# EAGLE design RiseUpBOTTOM (EAGLE 9.6.1)
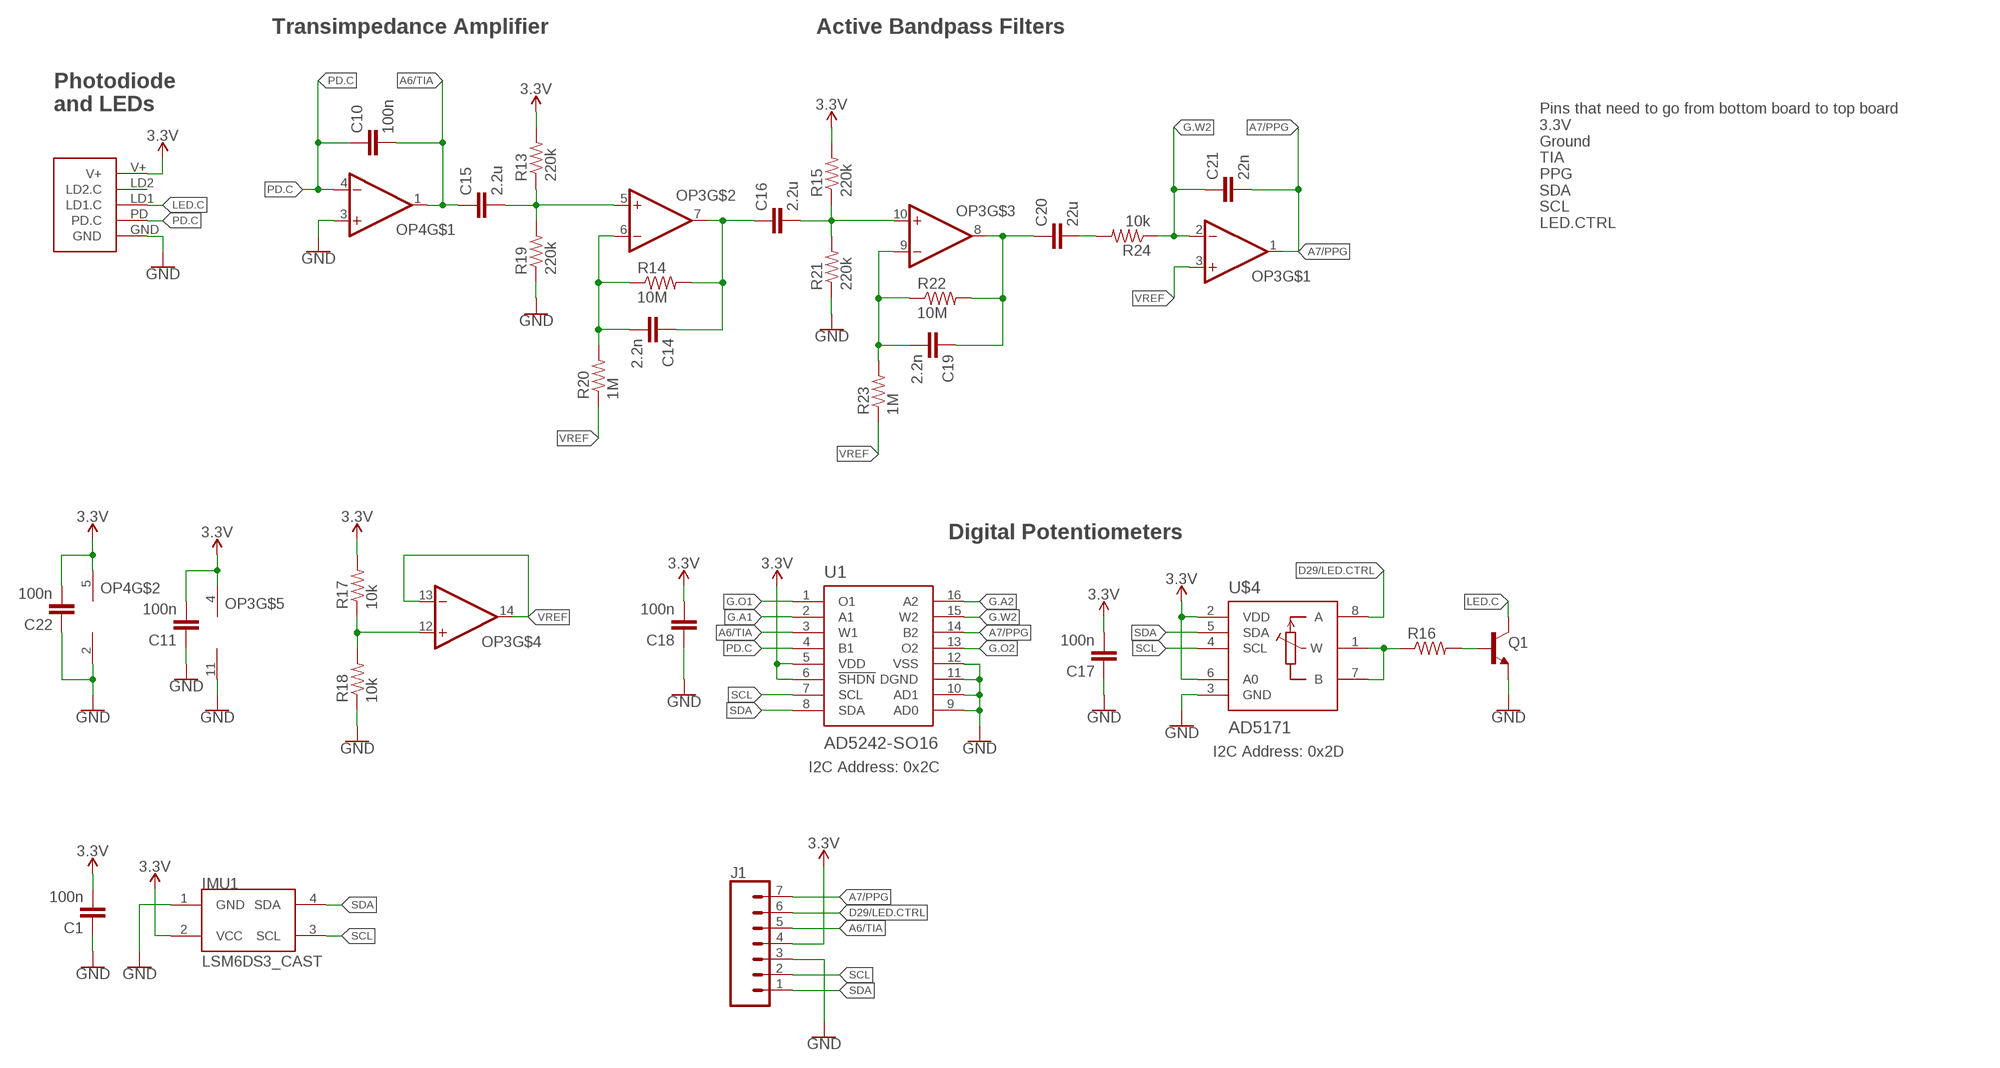
[diagram p0: schematic, sheet 1]

## Parts
C1  100n  CAPACITOR0603  [C0603]
C10  100n  CAPACITOR0603  [C0603]
C11  100n  CAPACITOR0603  [C0603]
C14  2.2n  CAPACITOR0603  [C0603]
C15  2.2u  CAPACITOR0603  [C0603]
C16  2.2u  CAPACITOR0603  [C0603]
C17  100n  CAPACITOR0603  [C0603]
C18  100n  CAPACITOR0603  [C0603]
C19  2.2n  CAPACITOR0603  [C0603]
C20  22u  CAPACITOR0603  [C0603]
C21  22n  CAPACITOR0603  [C0603]
C22  100n  CAPACITOR0603  [C0603]
IMU1  LSM6DS3_CAST  [LSM6DS3_CAST]
J1  CONN_07  [1X07]
OP3  OP-QUAD-SO14  [SO14]
OP4  OP-SINGLEOT  [SOT23-5]
Q1  NPN-GENERIC  [SOT23-3]
R13  220k  RESISTOR0603  [R0603]
R14  10M  RESISTOR0603  [R0603]
R15  220k  RESISTOR0603  [R0603]
R16  RESISTOR0603  [R0603]
R17  10k  RESISTOR0402  [R0402]
R18  10k  RESISTOR0402  [R0402]
R19  220k  RESISTOR0603  [R0603]
R20  1M  RESISTOR0603  [R0603]
R21  220k  RESISTOR0603  [R0603]
R22  10M  RESISTOR0603  [R0603]
R23  1M  RESISTOR0603  [R0603]
R24  10k  RESISTOR0603  [R0603]
U1  AD5242-SO16  [SO16]
U$3  PPG.MODULE.2  [PPG.MODULE.2]
U$4  AD5171  [SOT-23-8]

## Nets
3.3V: C1.2 C11.2 C17.2 C18.2 C22.2 IMU1.2(VCC) J1.4 OP3.4(V+) OP4.5(V+) R13.2 R15.2 R17.2 U1.5(VDD) U1.6(!SHDN) U$3.V+ U$4.2(VDD) U$4.6(A0)
A6/TIA: C10.2 C15.1 J1.5 OP4.1(OUT) U1.3(W1)
A7/PPG: C21.2 J1.7 OP3.1(OUT) U1.14(B2)
D29/LED.CTRL: J1.6 U$4.8(A)
G.A1: U1.2(A1)
G.A2: U1.16(A2)
G.O1: U1.1(O1)
G.O2: U1.13(O2)
G.W2: C21.1 OP3.2(-IN) R24.1 U1.15(W2)
GND: C1.1 C11.1 C17.1 C18.1 C22.1 IMU1.1(GND) J1.3 OP3.11(V-) OP4.2(V-) OP4.3(+IN) Q1.2(E) R18.1 R19.1 R21.1 U1.9(AD0) U1.10(AD1) U1.11(DGND) U1.12(VSS) U$3.GND U$4.3(GND)
LED.C: Q1.3(C) U$3.LD1(LD1.C)
N$8: Q1.1(B) R16.2
N$9: R16.1 U$4.1(W) U$4.7(B)
N$10: OP3.12(+IN) R17.1 R18.2
N$13: C15.2 OP3.5(+IN) R13.1 R19.2
N$15: C14.2 OP3.6(-IN) R14.1 R20.2
N$16: C14.1 C16.1 OP3.7(OUT) R14.2
N$17: C16.2 OP3.10(+IN) R15.1 R21.2
N$18: C19.2 OP3.9(-IN) R22.1 R23.2
N$19: C19.1 C20.1 OP3.8(OUT) R22.2
N$20: C20.2 R24.2
PD.C: C10.1 OP4.4(-IN) U1.4(B1) U$3.PD(PD.C)
SCL: IMU1.3(SCL) J1.2 U1.7(SCL) U$4.4(SCL)
SDA: IMU1.4(SDA) J1.1 U1.8(SDA) U$4.5(SDA)
VREF: OP3.3(+IN) OP3.13(-IN) OP3.14(OUT) R20.1 R23.1
Unconnected: U$3.LD2(LD2.C)

## Notes on the sheet
- Transimpedance Amplifier | Active Bandpass Filters
- Photodiode
  and LEDs
- Pins that need to go from bottom board to top board 
  3.3V
  Ground
  TIA 
  PPG 
  SDA
  SCL
  LED.CTRL
- Digital Potentiometers
- I2C Address: 0x2D
- I2C Address: 0x2C

## Library data of the parts
C1 C10 C11 C14-C22 = LinnesLab-Passives:CAPACITOR
IMU1 = LinnesLab-Sensors:LSM6DS3_CAST
J1 = LinnesLab-Connectors:CONN_07: Multi connection point. Often used as Generic Header-pin footprint for 0.1 inch spaced/style header connections On any of the 0.1 inch spaced packages, you can populate with these: Break Away Headers - Straight <https://www.sparkfun.com/products/116> (PRT-00116) Break Away Male Headers - Right Angle <https://www.sparkfun.com/products/553> (PRT-00553) Female Headers <https://www.sparkfun.com/products/115> (PRT-00115) Break Away Headers - Machine Pin <https://www.sparkfun.com/products/117> (PRT-00117) Break Away Female Headers - Swiss Machine Pin <https://www.sparkfun.com/products/743> (PRT-00743) For SCREWTERMINALS and SPRING TERMINALS visit here: Screw Terimnals on SparkFun.com <https://www.sparkfun.com/search/results?term=Screw+Terminals> (5mm/3.5mm/2.54mm spacing) This device is also useful as a general connection point to wire up your design to another part of your project. Our various solder wires solder well into these plated through hole pads. Hook-Up Wire - Assortment (Stranded, 22 AWG) <https://www.sparkfun.com/products/11375> (PRT-11375) Hook-Up Wire - Assortment (Solid Core, 22 AWG) <https://www.sparkfun.com/products/11367> (PRT-11367) View the entire wire category on our website here <https://www.sparkfun.com/categories/141> Special notes: Molex polarized connector foot print use with SKU : PRT-08231 with associated crimp pins and housings. 1MM SMD Version SKU: PRT-10208 NOTES ON THE VARIANTS LOCK and LOCK_LONGPADS... This footprint was designed to help hold the alignment of a through-hole component (i.e. 6-pin header) while soldering it into place. You may notice that each hole has been shifted either up or down by 0.005 of an inch from it's more standard position (which is a perfectly straight line). This slight alteration caused the pins (the squares in the middle) to touch the edges of the holes. Because they are alternating, it causes a "brace" to hold the component in place. 0.005 has proven to be the perfect amount of "off-center" position when using our standard breakaway headers. Although looks a little odd when you look at the bare footprint, once you have a header in there, the alteration is very hard to notice. Also,if you push a header all the way into place, it is covered up entirely on the bottom side.
OP3 = LinnesLab-AnalogIC:OP-QUAD: General symbol and footprints for Quad Op Amps. Use with any standard general purpose op amp.
OP4 = LinnesLab-AnalogIC:OP-SINGLE: Single Op Amp 2.7V to 6.0V Single Supply CMOS Source: http://ww1.microchip.com/downloads/en/DeviceDoc/21314g.pdf
Q1 = LinnesLab-DiscreteSemi:NPN
R13-R24 = LinnesLab-Passives:RESISTOR
U1 = LinnesLab-DigitalIC:AD5242
U$3 = LinnesLab-Connectors:PPG.MODULE.2: Digi-Key Part Number: S9014E-50-ND Manufacturer Part Number: GRPB501VWVN-RC Description: 1mm insulation height 0.05in pitch 50 positions
U$4 = LinnesLab-DigitalIC:AD5171

## Board
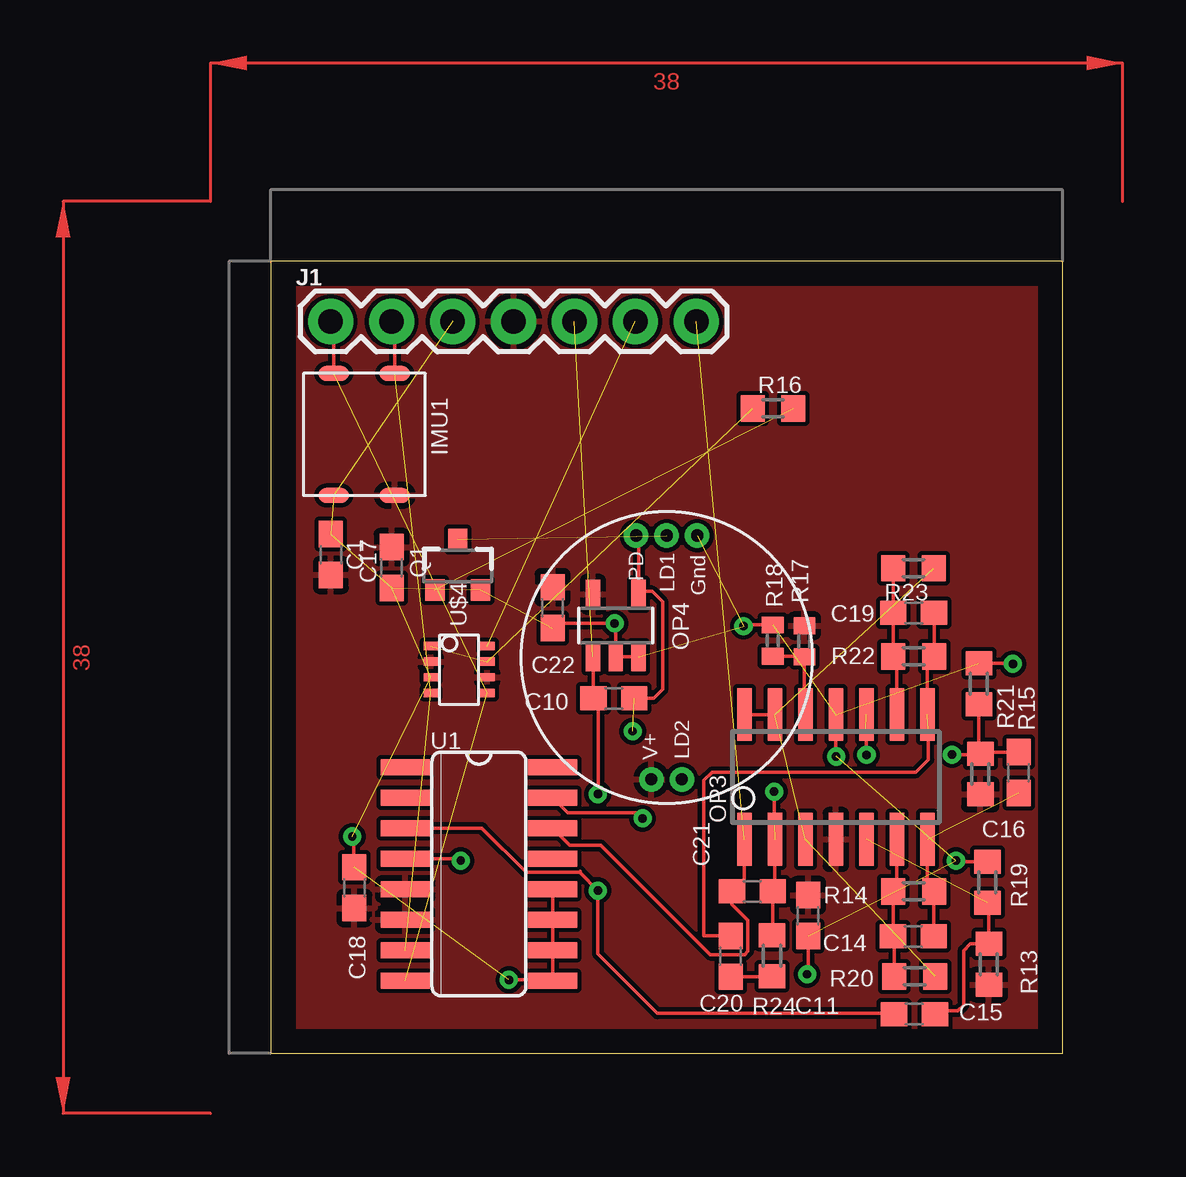
[diagram p1: board, top side]
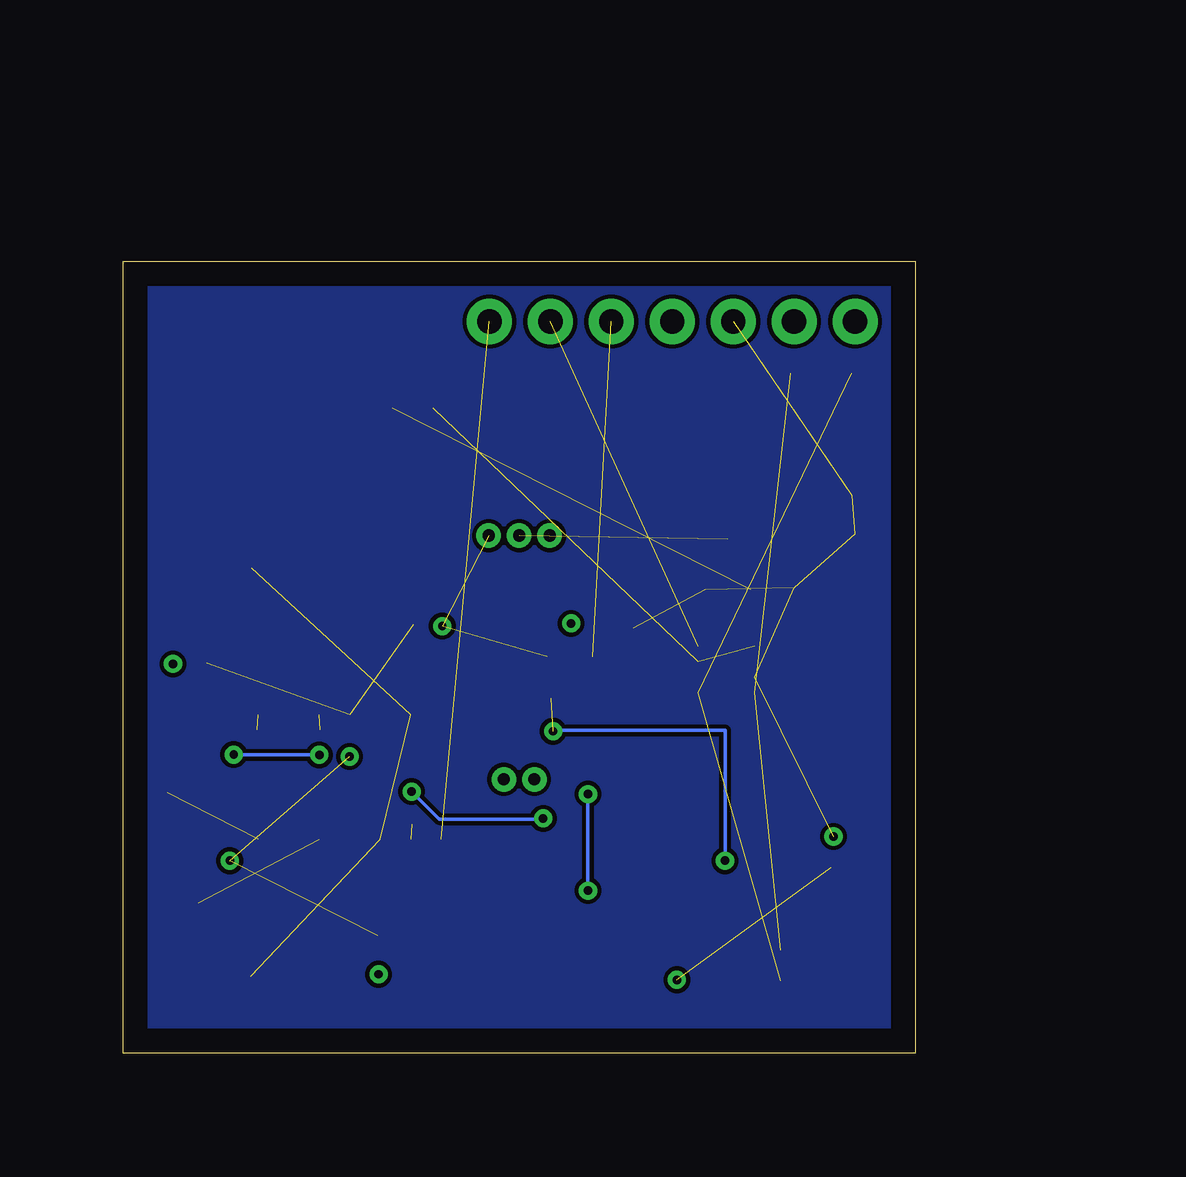
[diagram p2: board, bottom side, seen from below]

Size 33 x 33 mm. Coordinates in mm from the lower left corner, seen from the top.
Outline: 0,0 33,0 33,33 0,33 0,0
Copper layers (1*16): Top 0.035mm / dielectric 1.5mm / Bottom 0.035mm
Design rules "default": minimum track width 6mil, minimum drill 0.35mm, track to track 6mil, track to pad 6mil, pad to pad 6mil, via to via 6mil, smd to smd 6mil, copper to edge 40mil, drill to drill 6mil, minimum pad ring 10mil, minimum via ring 8mil, stop-mask expansion 4mil, vias tented up to drill 0mil, thermal gap 10mil

### Footprints (pad centres in the part's own frame; a part is rotated, then mirrored left to right if it is on the bottom)
C0603 = smd 1.1 x 1: 1 -0.85,0; 2 0.85,0
LSM6DS3_CAST = smd 0.635 x 1.27: 1 -2.54,1.27; 2 -2.54,-1.27; 3 2.54,-1.27; 4 2.54,1.27
1X07 = drill 1.016 pad 1.88: 1 0,0; 2 2.54,0; 3 5.08,0; 4 7.62,0; 5 10.16,0; 6 12.7,0; 7 15.24,0
SO14 = smd 0.6 x 2.2: 1 -3.81,-2.6; 2 -2.54,-2.6; 3 -1.27,-2.6; 4 0,-2.6; 5 1.27,-2.6; 6 2.54,-2.6; 7 3.81,-2.6; 8 3.81,2.6; 9 2.54,2.6; 10 1.27,2.6; 11 0,2.6; 12 -1.27,2.6; 13 -2.54,2.6; 14 -3.81,2.6
SOT23-5 = smd 0.6 x 1.2: 1 -0.95,-1.306; 2 0,-1.306; 3 0.95,-1.306; 4 0.95,1.306; 5 -0.95,1.306
SOT23-3 = smd 0.8 x 0.9: 1 -0.95,-1; 2 0.95,-1; 3 0,1.1
R0603 = smd 1 x 1.1: 1 -0.85,0; 2 0.85,0
R0402 = smd 0.7 x 0.9: 1 -0.65,0; 2 0.65,0
SO16 = smd 0.66 x 2.032: 1 -4.445,-3.073; 2 -3.175,-3.073; 3 -1.905,-3.073; 4 -0.635,-3.073; 5 0.635,-3.073; 6 1.905,-3.073; 7 3.175,-3.073; 8 4.445,-3.073; 9 4.445,3.073; 10 3.175,3.073; 11 1.905,3.073; 12 0.635,3.073; 13 -0.635,3.073; 14 -1.905,3.073; 15 -3.175,3.073; 16 -4.445,3.073
PPG.MODULE.2 = drill 0.508 pad 0.94: GND 1.27,5.08; LD1 0,5.08; LD2 0.635,-5.08; PD -1.27,5.08; V+ -0.635,-5.08
SOT-23-8 = smd 0.35 x 0.6: 1 -0.991,-1.176; 2 -0.341,-1.176; 3 0.309,-1.176; 4 0.959,-1.176; 5 0.959,1.176; 6 0.309,1.176; 7 -0.341,1.176; 8 -0.991,1.176

### Placement (x,y rotation side)
C1  2.51,20.79 270 top
C10  14.3,14.8 180 top
C11  22.4,5.74 90 top
C14  26.78,4.88 180 top
C15  26.82,1.64 0 top
C16  31.16,11.7 90 top
C17  5.04,20.25 90 top
C18  3.49,6.91 270 top
C19  26.79,18.36 180 top
C20  19.16,4.05 270 top
C21  20.07,6.76 180 top
C22  11.75,18.57 90 top
IMU1  3.9,25.8 90 top
J1  2.5,30.5 0 top
OP3  23.55,11.52 0 top
OP4  14.38,17.83 0 top
Q1  7.8,20.32 0 top
R13  29.93,3.72 270 top
R14  26.8,6.76 0 top
R15  29.57,11.65 270 top
R16  20.93,26.88 0 top
R17  22.24,17.17 90 top
R18  20.92,17.21 270 top
R19  29.86,7.13 270 top
R20  26.83,3.21 180 top
R21  29.51,15.4 270 top
R22  26.79,16.55 0 top
R23  26.79,20.22 180 top
R24  20.89,4.07 270 top
U1  8.68,7.48 270 top
U$3  16.5,16.5 0 top
U$4  7.86,15.99 270 top

### Tracks (layer width: path | path; a pad name or v marks a point on that pad's centre or on a via)
3.3V
  pour Top (isolate 0.178): 0.67,32.21 32.39,32.21 32.39,0.67 0.67,0.67
A6/TIA  (via drill 0.35)  (1 unrouted)
  Top 0.152: OP4.1 13.45,16.5 C10.2 13.64,14.61 13.64,10.77 13.63,10.77 v13.63,10.8 | C15.1 25.94,1.67 16.12,1.67 13.63,4.15 v13.63,6.78 12.9,7.52 12.9,7.59 12.86,7.56 10.64,7.56 8.8,9.39 5.61,9.39 U1.3
  Bottom 0.152: v13.63,10.8 v13.63,6.78
A7/PPG  (1 unrouted)
  Top 0.152: OP3.1 19.74,7.28 C21.2 19.22,6.21 19.89,5.54 19.89,4.25 19.76,4.12 18.32,4.12 13.76,8.67 12.46,8.67 U1.14
D29/LED.CTRL  (1 unrouted)
G.W2  (via drill 0.35)  (1 unrouted)
  Top 0.152: OP3.2 21.01,6.85 C21.1 20.92,4.95 R24.1 | v15.5,9.79 15.5,10.03 12.37,10.03 U1.15 | v20.98,10.91 20.98,9.55
  Bottom 0.152: v15.5,9.79 15.7,9.79 15.73,9.77 19.84,9.77 v20.98,10.91
GDN
  pour Bottom (isolate 0.178): 0.37,32.67 32.76,32.67 32.76,0.23 0.37,0.23 0.37,32.67
GND  (via drill 0.35)  (14 unrouted)
  Top 0.152: R18.1 19.75,17.86 v19.7,17.81 | OP3.11 23.55,12.38 v23.56,12.37 | R21.1 30.9,16.25 v30.92,16.23 | R19.1 28.6,7.98 v28.55,8.03 | C11.1 22.4,3.34 v22.35,3.3 | v3.4,9.04 3.46,9.04 3.46,7.79 C18.1 | C22.1 11.94,17.92 v14.34,17.92 14.38,17.87 OP4.2 OP4.3 | U1.12 U1.11 U1.10 U1.9 11.72,3.07 v9.93,3.07
LED.C  (1 unrouted)
N$8  (1 unrouted)
N$9  (2 unrouted)
N$10
  Top 0.152: R18.2 22.21,16.55 R17.1 22.24,14.17 OP3.12
N$13  (1 unrouted)
  Top 0.152: R19.2 29.93,6.22 R13.1 29.16,4.57 28.87,4.29 28.87,2.01 28.64,1.78 27.81,1.78 C15.2
N$15
  Top 0.152: OP3.6 26.09,6.9 R14.1 25.95,4.9 C14.2 25.98,4.82 R20.2
N$16  (1 unrouted)
  Top 0.152: C14.1 27.63,6.73 R14.2 27.36,7.04 OP3.7
N$17  (via drill 0.35)  (1 unrouted)
  Top 0.152: R21.2 29.51,12.56 R15.1 | C16.2 29.63,12.55 R15.1 | v28.39,12.45 29.52,12.45 R15.1 | v24.82,12.44 24.82,13.46 24.79,13.5
  Bottom 0.152: v28.39,12.45 v28.38,12.44 v24.82,12.44
N$18
  Top 0.152: OP3.9 26.09,16.4 R22.1 C19.2 R23.2
N$19  (1 unrouted)
  Top 0.152: C20.1 18.05,4.9 18.05,11.37 18.39,11.71 26.88,11.71 27.4,12.24 27.4,13.48 | OP3.8 27.36,16.27 R22.2 C19.1
N$20
  Top 0.152: C20.2 20.86,3.2 R24.2
PD.C  (via drill 0.35)  (1 unrouted)
  Top 0.152: U$3.PD 15.33,21.48 15.33,19.25 | 15.33,19.25 OP4.4 | C10.1 15.96,14.8 16.33,15.17 16.33,18.82 15.9,19.25 15.33,19.25 | U1.4 7.84,8.12 v7.92,8.03
  Bottom 0.152: v7.92,8.03 7.92,13.46 15.05,13.46 v15.08,13.43
SCL  (2 unrouted)
  Top 0.152: J1.2 5.17,30.37 IMU1.3
SDA  (2 unrouted)
  Top 0.152: J1.1 2.63,30.37 IMU1.4
VREF  (3 unrouted)
  Top 0.152: OP3.14 OP3.13
(copper drawn outside any net)
  shapes: Top area x2